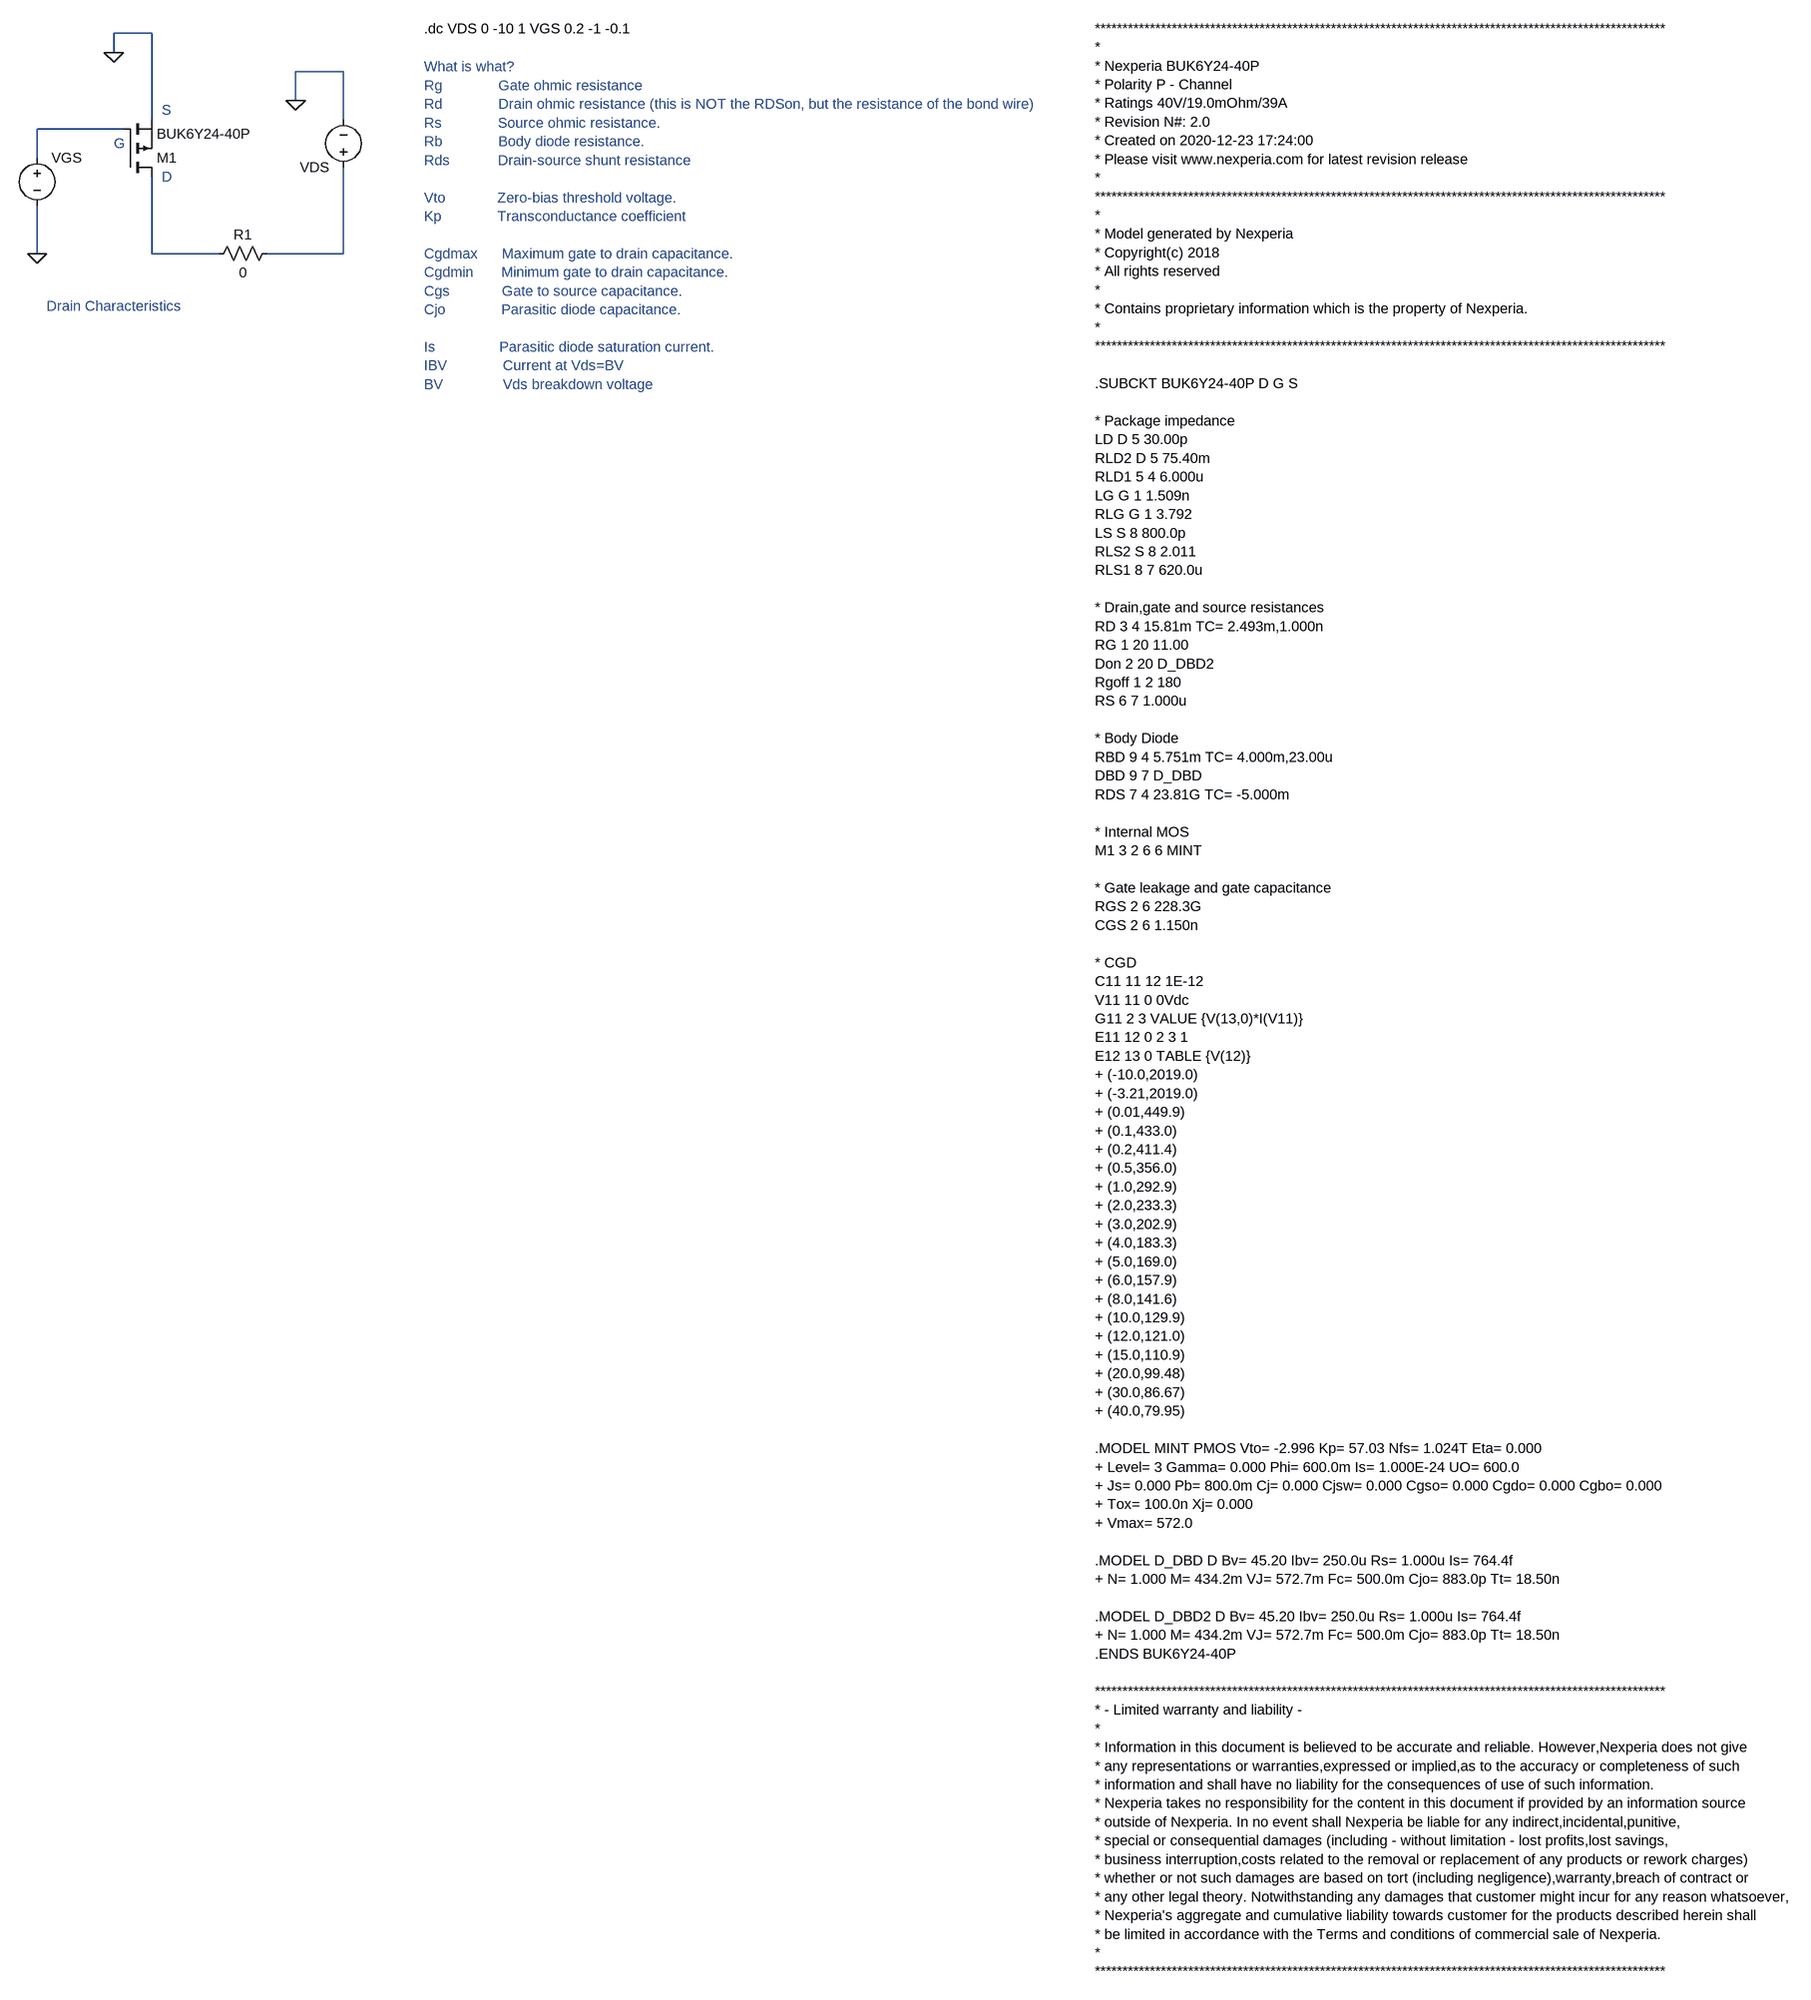
[diagram p0: schematic Draft3.asc]
Draft3.asc, the LTspice schematic file:
Version 4
SHEET 1 2508 2904
WIRE -688 -16 -752 -16
WIRE -752 16 -752 -16
WIRE -368 48 -448 48
WIRE -448 96 -448 48
WIRE -688 128 -688 -16
WIRE -368 128 -368 48
WIRE -736 144 -880 144
WIRE -880 192 -880 144
WIRE -880 352 -880 272
WIRE -688 352 -688 224
WIRE -576 352 -688 352
WIRE -368 352 -368 208
WIRE -368 352 -496 352
FLAG -880 352 0
FLAG -752 16 0
FLAG -448 96 0
SYMBOL voltage -880 176 R0
SYMATTR InstName VGS
SYMATTR Value ""
SYMBOL voltage -368 224 R180
WINDOW 3 24 -12 Left 2
WINDOW 123 0 0 Left 0
WINDOW 39 0 0 Left 0
SYMATTR Value ""
SYMATTR InstName VDS
SYMBOL res -480 336 R90
WINDOW 0 0 56 VBottom 2
WINDOW 3 32 56 VTop 2
SYMATTR InstName R1
SYMATTR Value 0
SYMBOL pmos -736 224 M180
SYMATTR InstName M1
SYMATTR Value BUK6Y24-40P
SYMATTR Prefix X
TEXT 984 -24 Left 2 !********************************************************************************************************\n*\n* Nexperia BUK6Y24-40P\n* Polarity P - Channel\n* Ratings 40V/19.0mOhm/39A\n* Revision N#: 2.0\n* Created on 2020-12-23 17:24:00\n* Please visit www.nexperia.com for latest revision release\n*\n********************************************************************************************************\n*\n* Model generated by Nexperia\n* Copyright(c) 2018\n* All rights reserved\n*\n* Contains proprietary information which is the property of Nexperia.\n*\n********************************************************************************************************\n \n.SUBCKT BUK6Y24-40P D G S\n \n* Package impedance\nLD D 5 30.00p\nRLD2 D 5 75.40m\nRLD1 5 4 6.000u\nLG G 1 1.509n\nRLG G 1 3.792\nLS S 8 800.0p\nRLS2 S 8 2.011\nRLS1 8 7 620.0u\n \n* Drain,gate and source resistances\nRD 3 4 15.81m TC= 2.493m,1.000n\nRG 1 20 11.00\nDon 2 20 D_DBD2\nRgoff 1 2 180\nRS 6 7 1.000u\n \n* Body Diode\nRBD 9 4 5.751m TC= 4.000m,23.00u\nDBD 9 7 D_DBD\nRDS 7 4 23.81G TC= -5.000m\n \n* Internal MOS\nM1 3 2 6 6 MINT\n \n* Gate leakage and gate capacitance\nRGS 2 6 228.3G\nCGS 2 6 1.150n\n \n* CGD\nC11 11 12 1E-12\nV11 11 0 0Vdc\nG11 2 3 VALUE {V(13,0)*I(V11)}\nE11 12 0 2 3 1\nE12 13 0 TABLE {V(12)}\n+ (-10.0,2019.0)\n+ (-3.21,2019.0)\n+ (0.01,449.9)\n+ (0.1,433.0)\n+ (0.2,411.4)\n+ (0.5,356.0)\n+ (1.0,292.9)\n+ (2.0,233.3)\n+ (3.0,202.9)\n+ (4.0,183.3)\n+ (5.0,169.0)\n+ (6.0,157.9)\n+ (8.0,141.6)\n+ (10.0,129.9)\n+ (12.0,121.0)\n+ (15.0,110.9)\n+ (20.0,99.48)\n+ (30.0,86.67)\n+ (40.0,79.95)\n \n.MODEL MINT PMOS Vto= -2.996 Kp= 57.03 Nfs= 1.024T Eta= 0.000\n+ Level= 3 Gamma= 0.000 Phi= 600.0m Is= 1.000E-24 UO= 600.0\n+ Js= 0.000 Pb= 800.0m Cj= 0.000 Cjsw= 0.000 Cgso= 0.000 Cgdo= 0.000 Cgbo= 0.000\n+ Tox= 100.0n Xj= 0.000\n+ Vmax= 572.0\n \n.MODEL D_DBD D Bv= 45.20 Ibv= 250.0u Rs= 1.000u Is= 764.4f\n+ N= 1.000 M= 434.2m VJ= 572.7m Fc= 500.0m Cjo= 883.0p Tt= 18.50n\n \n.MODEL D_DBD2 D Bv= 45.20 Ibv= 250.0u Rs= 1.000u Is= 764.4f\n+ N= 1.000 M= 434.2m VJ= 572.7m Fc= 500.0m Cjo= 883.0p Tt= 18.50n\n.ENDS BUK6Y24-40P\n \n********************************************************************************************************\n* - Limited warranty and liability -\n*\n* Information in this document is believed to be accurate and reliable. However,Nexperia does not give\n* any representations or warranties,expressed or implied,as to the accuracy or completeness of such\n* information and shall have no liability for the consequences of use of such information.\n* Nexperia takes no responsibility for the content in this document if provided by an information source\n* outside of Nexperia. In no event shall Nexperia be liable for any indirect,incidental,punitive,\n* special or consequential damages (including - without limitation - lost profits,lost savings,\n* business interruption,costs related to the removal or replacement of any products or rework charges)\n* whether or not such damages are based on tort (including negligence),warranty,breach of contract or\n* any other legal theory. Notwithstanding any damages that customer might incur for any reason whatsoever,\n* Nexperia's aggregate and cumulative liability towards customer for the products described herein shall\n* be limited in accordance with the Terms and conditions of commercial sale of Nexperia.\n*\n********************************************************************************************************
TEXT -200 -24 Left 2 !.dc VDS 0 -10 1 VGS 0.2 -1 -0.1
TEXT -200 40 Left 2 ;What is what?\nRg              Gate ohmic resistance\nRd              Drain ohmic resistance (this is NOT the RDSon, but the resistance of the bond wire)\nRs              Source ohmic resistance.\nRb              Body diode resistance.          \nRds            Drain-source shunt resistance\n \nVto             Zero-bias threshold voltage.\nKp              Transconductance coefficient\n \nCgdmax      Maximum gate to drain capacitance.\nCgdmin       Minimum gate to drain capacitance.\nCgs             Gate to source capacitance.\nCjo              Parasitic diode capacitance.\n \nIs                Parasitic diode saturation current.\nIBV              Current at Vds=BV\nBV               Vds breakdown voltage
TEXT -864 440 Left 2 ;Drain Characteristics
TEXT -672 112 Left 2 ;S
TEXT -752 168 Left 2 ;G
TEXT -672 224 Left 2 ;D

The netlist it stands for:
* Draft3.asc
VGS N001 0
VDS N003 0
R1 N003 N002 0
XM1 N002 N001 0 BUK6Y24-40P  ; pins D G S
********************************************************************************************************
*
* Nexperia BUK6Y24-40P
* Polarity P - Channel
* Ratings 40V/19.0mOhm/39A
* Revision N#: 2.0
* Created on 2020-12-23 17:24:00
* Please visit www.nexperia.com for latest revision release
*
********************************************************************************************************
*
* Model generated by Nexperia
* Copyright(c) 2018
* All rights reserved
*
* Contains proprietary information which is the property of Nexperia.
*
********************************************************************************************************
.SUBCKT BUK6Y24-40P D G S
* Package impedance
LD D 5 30.00p
RLD2 D 5 75.40m
RLD1 5 4 6.000u
LG G 1 1.509n
RLG G 1 3.792
LS S 8 800.0p
RLS2 S 8 2.011
RLS1 8 7 620.0u
* Drain,gate and source resistances
RD 3 4 15.81m TC= 2.493m,1.000n
RG 1 20 11.00
Don 2 20 D_DBD2
Rgoff 1 2 180
RS 6 7 1.000u
* Body Diode
RBD 9 4 5.751m TC= 4.000m,23.00u
DBD 9 7 D_DBD
RDS 7 4 23.81G TC= -5.000m
* Internal MOS
M1 3 2 6 6 MINT
* Gate leakage and gate capacitance
RGS 2 6 228.3G
CGS 2 6 1.150n
* CGD
C11 11 12 1E-12
V11 11 0 0Vdc
G11 2 3 VALUE {V(13,0)*I(V11)}
E11 12 0 2 3 1
E12 13 0 TABLE {V(12)}
+ (-10.0,2019.0)
+ (-3.21,2019.0)
+ (0.01,449.9)
+ (0.1,433.0)
+ (0.2,411.4)
+ (0.5,356.0)
+ (1.0,292.9)
+ (2.0,233.3)
+ (3.0,202.9)
+ (4.0,183.3)
+ (5.0,169.0)
+ (6.0,157.9)
+ (8.0,141.6)
+ (10.0,129.9)
+ (12.0,121.0)
+ (15.0,110.9)
+ (20.0,99.48)
+ (30.0,86.67)
+ (40.0,79.95)
.MODEL MINT PMOS Vto= -2.996 Kp= 57.03 Nfs= 1.024T Eta= 0.000
+ Level= 3 Gamma= 0.000 Phi= 600.0m Is= 1.000E-24 UO= 600.0
+ Js= 0.000 Pb= 800.0m Cj= 0.000 Cjsw= 0.000 Cgso= 0.000 Cgdo= 0.000 Cgbo= 0.000
+ Tox= 100.0n Xj= 0.000
+ Vmax= 572.0
.MODEL D_DBD D Bv= 45.20 Ibv= 250.0u Rs= 1.000u Is= 764.4f
+ N= 1.000 M= 434.2m VJ= 572.7m Fc= 500.0m Cjo= 883.0p Tt= 18.50n
.MODEL D_DBD2 D Bv= 45.20 Ibv= 250.0u Rs= 1.000u Is= 764.4f
+ N= 1.000 M= 434.2m VJ= 572.7m Fc= 500.0m Cjo= 883.0p Tt= 18.50n
.ENDS BUK6Y24-40P
********************************************************************************************************
* - Limited warranty and liability -
*
* Information in this document is believed to be accurate and reliable. However,Nexperia does not give
* any representations or warranties,expressed or implied,as to the accuracy or completeness of such
* information and shall have no liability for the consequences of use of such information.
* Nexperia takes no responsibility for the content in this document if provided by an information source
* outside of Nexperia. In no event shall Nexperia be liable for any indirect,incidental,punitive,
* special or consequential damages (including - without limitation - lost profits,lost savings,
* business interruption,costs related to the removal or replacement of any products or rework charges)
* whether or not such damages are based on tort (including negligence),warranty,breach of contract or
* any other legal theory. Notwithstanding any damages that customer might incur for any reason whatsoever,
* Nexperia's aggregate and cumulative liability towards customer for the products described herein shall
* be limited in accordance with the Terms and conditions of commercial sale of Nexperia.
*
********************************************************************************************************
.dc VDS 0 -10 1 VGS 0.2 -1 -0.1
* What is what?
* Rg              Gate ohmic resistance
* Rd              Drain ohmic resistance (this is NOT the RDSon, but the resistance of the bond wire)
* Rs              Source ohmic resistance.
* Rb              Body diode resistance.
* Rds            Drain-source shunt resistance
* Vto             Zero-bias threshold voltage.
* Kp              Transconductance coefficient
* Cgdmax      Maximum gate to drain capacitance.
* Cgdmin       Minimum gate to drain capacitance.
* Cgs             Gate to source capacitance.
* Cjo              Parasitic diode capacitance.
* Is                Parasitic diode saturation current.
* IBV              Current at Vds=BV
* BV               Vds breakdown voltage
* Drain Characteristics
* S
* G
* D
.backanno
.end